# Altium schematic sheet CPU.SchDoc
size A4
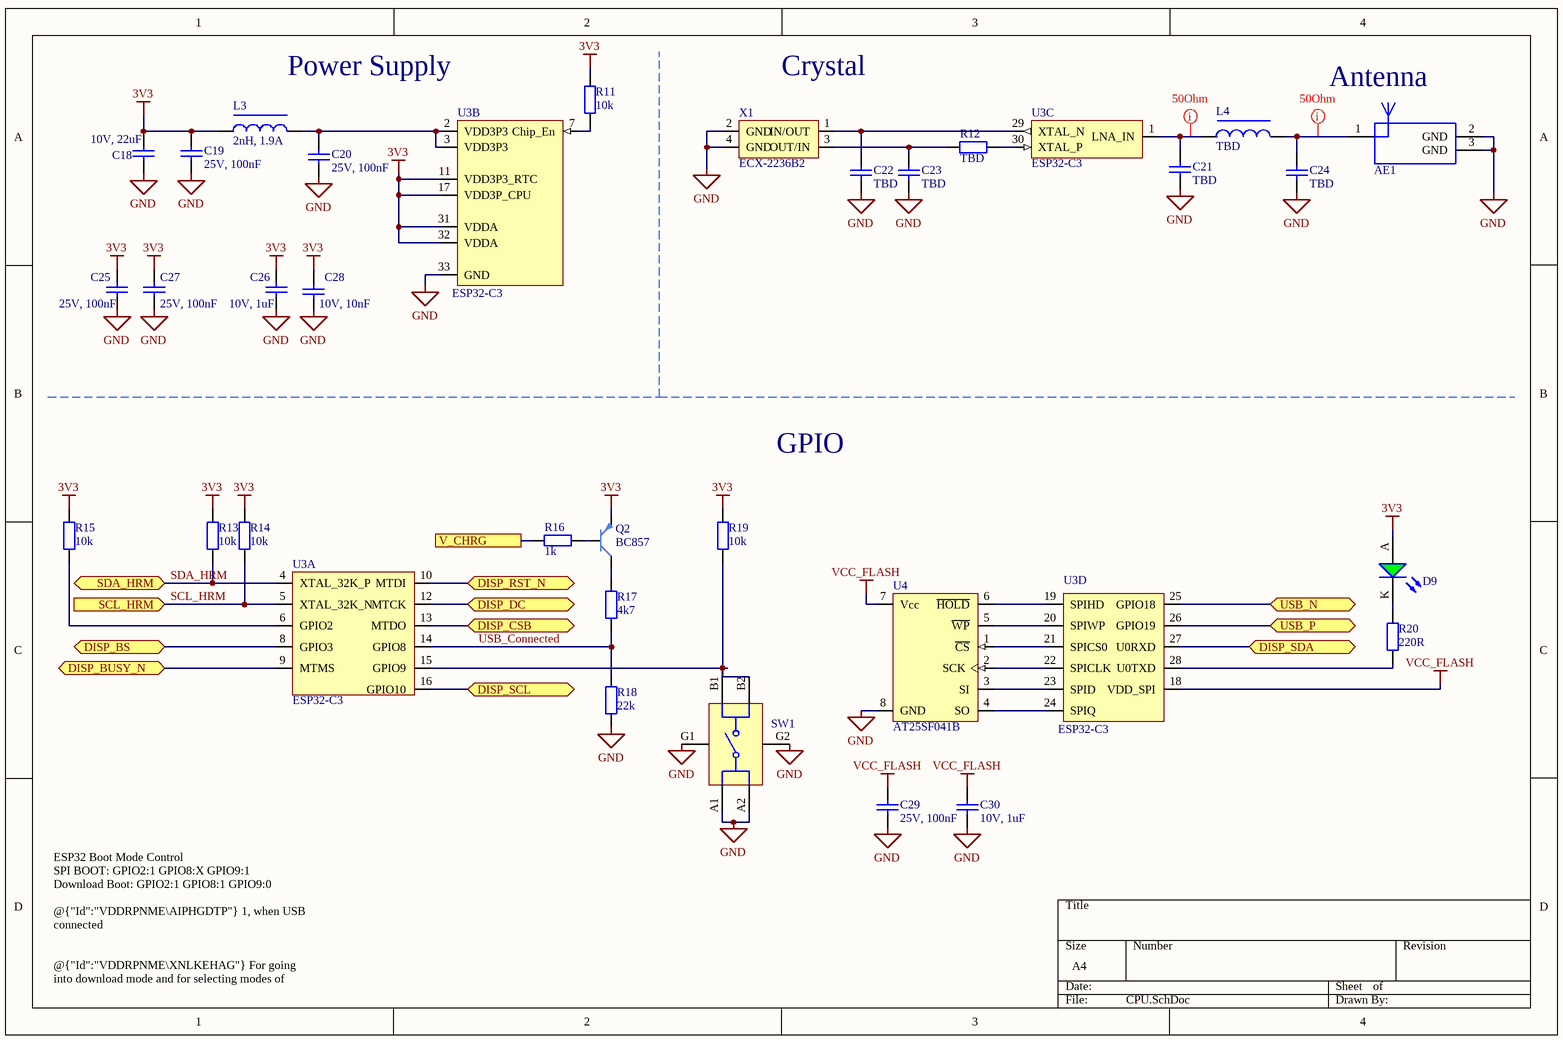
[diagram p0: CPU.SchDoc]

## Parts
AE1  7488960245  [7488960245]  (value not drawn)
C18  10V, 22uF  [0805_2x1.25x1.25mm_Reflow Soldering]
C19  25V, 100nF  [0402_1x0.5x0.5mm]
C20  25V, 100nF  [0402_1x0.5x0.5mm]
C21  TBD  [0402_1x0.5x0.5mm]
C22  TBD  [0402_1x0.5x0.5mm]
C23  TBD  [0402_1x0.5x0.5mm]
C24  TBD  [0402_1x0.5x0.5mm]
C25  25V, 100nF  [0402_1x0.5x0.5mm]
C26  10V, 1uF  [0402_1x0.5x0.5mm]
C27  25V, 100nF  [0402_1x0.5x0.5mm]
C28  10V, 10nF  [0402_1x0.5x0.5mm]
C29  25V, 100nF  [0402_1x0.5x0.5mm]
C30  10V, 1uF  [0402_1x0.5x0.5mm]
D9  Green, 3.2V, 140°  [WL-SMCW_0603_150060xx75003]  (value not drawn)
L3  2nH, 1.9A  [0603CT SERIES]
L4  TBD  [0402CS SERIES]
Q2  BC857  [SOT23]
R11  10k  [R0402]
R12  TBD  [R0402]
R13  10k  [R0402]
R14  10k  [R0402]
R15  10k  [R0402]
R16  1k  [R0402]
R17  4k7  [R0402]
R18  22k  [R0402]
R19  10k  [R0402]
R20  220R  [R0402]
SW1  435151014845  [WS-TASV_L3W2.6H1.4_4351x10148xx]  (value not drawn)
U3  ESP32-C3  [32L SLP Expressif]  (parts A,B,C,D of 4)
U4  AT25SF041B  [SOIC8 Wide dialog semi]
X1  ECX-2236B2  [2.5 x 2.0 mm XTAL]

## Ports
DISP_BS (bidir), DISP_BUSY_N (bidir), DISP_CSB (bidir), DISP_DC (bidir), DISP_RST_N (bidir), DISP_SCL (bidir), DISP_SDA (bidir), SCL_HRM (in), SDA_HRM (bidir), USB_N (bidir), USB_P (bidir), V_CHRG

## Nets
3V3: C18.1 C19.2 C25.2 C26.2 C27.2 C28.2 D9.A L3.1 Q2.2(E) R11.2 R13.2 R14.2 R15.2 R19.2 U3.11(VDD3P3_RTC) U3.17(VDD3P_CPU) U3.31(VDDA) U3.32(VDDA)
GND: AE1.2(GND) AE1.3(GND) C18.2 C19.1 C20.1 C21.1 C22.1 C23.1 C24.1 C25.1 C26.1 C27.1 C28.1 C29.1 C30.1 R18.1 SW1.A1 SW1.A2 SW1.G1(GND) SW1.G2(GND) U3.33(GND) U4.8(GND) X1.2(GND) X1.4(GND)
VCC_FLASH: C29.2 C30.2 U3.18(VDD_SPI) U4.7(Vcc)
DISP_BS: U3.8(GPIO3) ; port DISP_BS
DISP_BUSY_N: U3.9(MTMS) ; port DISP_BUSY_N
DISP_CSB: U3.13(MTDO) ; port DISP_CSB
DISP_DC: U3.12(MTCK) ; port DISP_DC
DISP_RST_N: U3.10(MTDI) ; port DISP_RST_N
DISP_SCL: U3.16(GPIO10) ; port DISP_SCL
DISP_SDA: U3.27(U0RXD) ; port DISP_SDA
SCL_HRM: R14.1 U3.5(XTAL_32K_N) ; port SCL_HRM
SDA_HRM: R13.1 U3.4(XTAL_32K_P) ; port SDA_HRM
USB_Connected: R17.1 R18.2 U3.14(GPIO8)
USB_N: U3.25(GPIO18) ; port USB_N
USB_P: U3.26(GPIO19) ; port USB_P
V_CHRG: R16.2 ; port V_CHRG
NetAE1_1: AE1.1(Feed) C24.2 L4.2
NetC20_2: C20.2 L3.2 U3.2(VDD3P3) U3.3(VDD3P3)
NetC21_2: C21.2 L4.1 U3.1(LNA_IN)
NetC22_2: C22.2 U3.29(XTAL_N) X1.1(IN/OUT)
NetC23_2: C23.2 R12.2 X1.3(OUT/IN)
NetD9_K: D9.K R20.2
NetQ2_1: Q2.1(B) R16.1
NetQ2_3: Q2.3(C) R17.2
NetR11_1: R11.1 U3.7(Chip_En)
NetR12_1: R12.1 U3.30(XTAL_P)
NetR15_1: R15.1 U3.6(GPIO2)
NetR19_1: R19.1 SW1.B2
NetR20_1: R20.1 U3.28(U0TXD)
NetSW1_B1: SW1.B1 U3.15(GPIO9)
NetU3_19: U3.19(SPIHD) U4.6(~{HOLD})
NetU3_20: U3.20(SPIWP) U4.5(~{WP})
NetU3_21: U3.21(SPICS0) U4.1(~{CS})
NetU3_22: U3.22(SPICLK) U4.2(SCK)
NetU3_23: U3.23(SPID) U4.3(SI)
NetU3_24: U3.24(SPIQ) U4.4(SO)

## Layout directives
mark named 50Ohm: NetAE1_1, NetC21_2

## Notes on the sheet
- Power Supply
- (near X1) Crystal
- (near AE1) Antenna
- GPIO
- ESP32 Boot Mode Control
  SPI BOOT: GPIO2:1 GPIO8:X GPIO9:1
  Download Boot: GPIO2:1 GPIO8:1 GPIO9:0
  @{"Id":"VDDRPNME\AIPHGDTP"} 1, when USB connected
  @{"Id":"VDDRPNME\XNLKEHAG"} For going into download mode and for selecting modes of operation

## Library data of the parts
AE1 = 7488960245: WE-MCA SMT Multilayer Chip Antenna, 1 Band, 2400-2500MHz, 50Ω; Manufacturer: Wurth Elektronik; Number of Bands: 1; Peak Gain: 3dBi; VSWR: 2.5; ComponentLink1Description: Website Link; ComponentLink1URL: https://www.we-online.com/redexpert/article/7488960245?ad; ComponentLink2Description: Datasheet Link; ComponentLink2URL: https://www.we-online.com/redexpert/spec/7488960245?ad; Manufacturer Part Number: 7488960245; Category: Antennas; Match Code: WE-MCA; Mount: Surface Mount; Operating Temperature Max: 85°C; Operating Temperature Min: -40°C; Packaging: Tape and Reel; Length: 5.2mm; Width: 3.7mm; Height: 0.7mm; Frequency Range: 2400-2500MHz; Impedance: 50Ω
C18 = 885012107011: WCAP-CSGP Ceramic Capacitors, 0805, X5R, 10V, 22uF; Rated Voltage: 10V DC; ComponentLink1Description: Manufacturer; ComponentLink1URL: http://www.we-online.de; ComponentLink2Description: Datasheet; ComponentLink2URL: http://katalog.we-online.de/pbs/datasheet/885012107011.pdf; Part Number: 885012107011; Published Date: Oct. 2017; Publisher: Wurth Elektronik; Size: 0805; Operating Temperature: -55 °C to +125 °C; Value: 22uF; Ceramic Type: X5R
C19 C20 C25 C27 C29 = 885012105018: WCAP-CSGP Ceramic Capacitors, 0402, X5R, 25V, 100nF; Rated Voltage: 25V DC; ComponentLink1Description: Manufacturer; ComponentLink1URL: http://www.we-online.de; ComponentLink2Description: Datasheet; ComponentLink2URL: http://katalog.we-online.de/pbs/datasheet/885012105018.pdf; Part Number: 885012105018; Published Date: Oct. 2017; Publisher: Wurth Elektronik; Size: 0402; Operating Temperature: -55 °C to +125 °C; Value: 100nF; Ceramic Type: X5R
C21-C24 = 885012005021: WCAP-CSGP Ceramic Capacitors, 0402, NP0, 16V, 2.2pF; Rated Voltage: 16V DC; ComponentLink1Description: Manufacturer; ComponentLink1URL: http://www.we-online.de; ComponentLink2Description: Datasheet; ComponentLink2URL: http://katalog.we-online.de/pbs/datasheet/885012005021.pdf; Part Number: 885012005021; Published Date: Oct. 2017; Publisher: Wurth Elektronik; Size: 0402; Operating Temperature: -55 °C to +125 °C; Value: 2.2pF; Ceramic Type: NP0
C26 C30 = 885012105012: WCAP-CSGP Ceramic Capacitors, 0402, X5R, 10V, 1uF; Rated Voltage: 10V DC; ComponentLink1Description: Manufacturer; ComponentLink1URL: http://www.we-online.de; ComponentLink2Description: Datasheet; ComponentLink2URL: http://katalog.we-online.de/pbs/datasheet/885012105012.pdf; Part Number: 885012105012; Published Date: Oct. 2017; Publisher: Wurth Elektronik; Size: 0402; Operating Temperature: -55 °C to +125 °C; Value: 1uF; Ceramic Type: X5R
C28 = 885012205012: WCAP-CSGP Ceramic Capacitors, 0402, X7R, 10V, 10nF; Rated Voltage: 10V DC; ComponentLink1Description: Manufacturer; ComponentLink1URL: http://www.we-online.de; ComponentLink2Description: Datasheet; ComponentLink2URL: http://katalog.we-online.de/pbs/datasheet/885012205012.pdf; Part Number: 885012205012; Published Date: Oct. 2017; Publisher: Wurth Elektronik; Size: 0402; Operating Temperature: -55 °C to +125 °C; Value: 10nF; Ceramic Type: X7R
D9 = 150060GS75003: WL-SMCW Mono-color Chip LED Waterclear, SMT, size 0603, Green, 3.2V, 140°; Manufacturer: Wurth Elektronik; Case/Size Code: 0603; Chip Technology: InGaN; Dominant Wavelength: 525nm; Luminous Intensity: 1600mcd; Peak Wavelength: 515nm; Manufacturer Part Number: 150060GS75003; Category: Signal LEDs; Match Code: WL-SMCW; ComponentLink1Description: Website Link; ComponentLink1URL: https://www.we-online.com/redexpert/article/150060GS75003?ad; ComponentLink2Description: Datasheet Link; ComponentLink2URL: https://www.we-online.com/redexpert/spec/150060GS75003?ad; Mount: Surface Mount; Operating Temperature Max: 100°C; Operating Temperature Min: -40°C; Packaging: Tape and Reel; Length: 1.6mm; Width: 0.8mm; Height: 0.7mm; Emitting Color: Green; Forward Voltage: 3.2V; Viewing Angle: 140°
L3 = 0603CT-2N0XJRW
L4 = 0402CT: 0402 Coil - Coilcraft
R11-R20 = Res 0402
SW1 = 435151014845: WS-TASV SMT Tact Switch with ground terminal, SPST-NO, 12VDC, 50mA, 450g; Manufacturer: Wurth Elektronik; Washable: No; ComponentLink1Description: Website Link; ComponentLink1URL: https://www.we-online.com/redexpert/article/435151014845?ad; ComponentLink2Description: Datasheet Link; ComponentLink2URL: https://www.we-online.com/redexpert/spec/435151014845?ad; Manufacturer Part Number: 435151014845; Category: Tact Switches; Match Code: WS-TASV; Mount: Surface Mount; Operating Temperature Max: 85°C; Operating Temperature Min: -40°C; Packaging: Tape and Reel; Length: 3mm; Width: 2.6mm; Height: 1.4mm; Circuit: SPST-NO; Contact Material: Stainless Steel; Contact Plating: Silver; Operation Force: 450g; Rated Current: 50mA; Rated Voltage: 12VDC; Terminal Material: Copper Alloy; Terminal Plating: Silver
U3 = ESP32-C3: Ultra­Low­Power SoC with RISC­V Single­Core CPU / Supporting IEEE 802.11b/g/n (2.4 GHz Wi­Fi) and Bluetooth® 5 (LE)
U4 = AT25SF041B: 4-Mbit SPI Serial Flash Memory with Dual-I/O and Quad-I/O Support
X1 = ECX-2236B2: ECX-2236B2 SMD CRYSTAL 40MHz +-10ppm